# EAGLE design schmitt trigger (EAGLE 7.6.0)
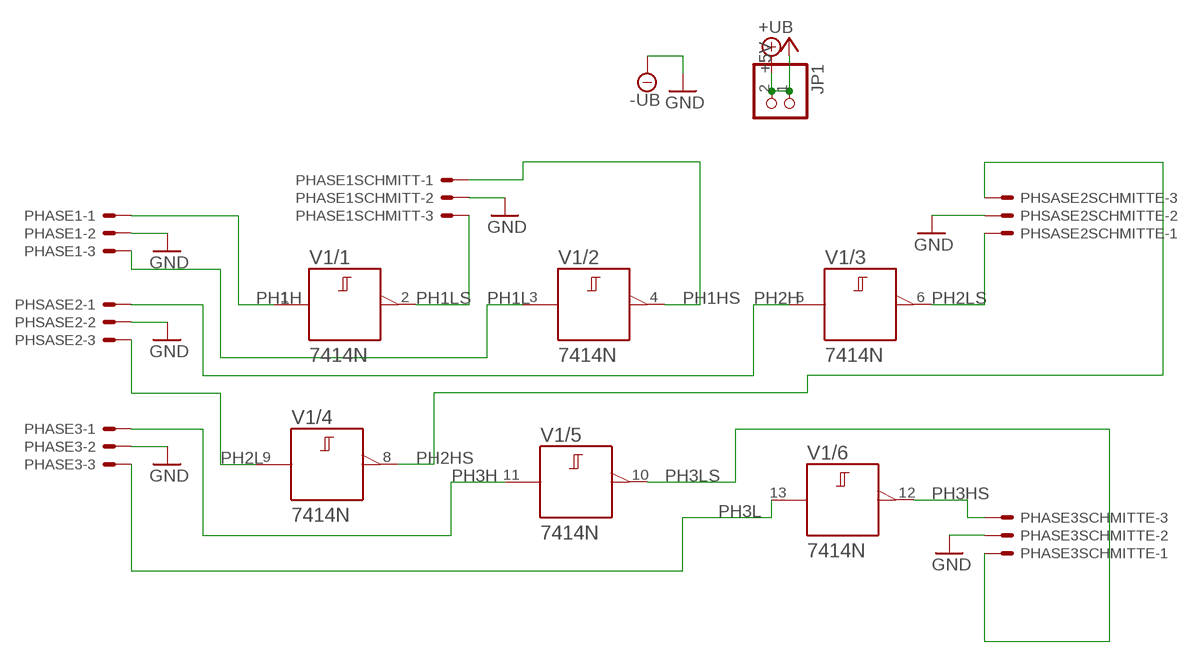
[diagram p0: schematic, sheet 1]

## Parts
JP1  PINHD-1X2  [1X02]
PHASE1  22-23-2031  [22-23-2031]
PHASE1SCHMITT  22-23-2031  [22-23-2031]
PHASE3  22-23-2031  [22-23-2031]
PHASE3SCHMITTE  22-23-2031  [22-23-2031]
PHSASE2  22-23-2031  [22-23-2031]
PHSASE2SCHMITTE  22-23-2031  [22-23-2031]
V1  7414N  [DIL14]

## Nets
+5V: JP1.1 JP1.2 ; supply symbol labelled +UB
GND: PHASE1.2 PHASE1SCHMITT.2 PHASE3.2 PHASE3SCHMITTE.2 PHSASE2.2 PHSASE2SCHMITTE.2 ; supply symbol labelled -UB
PH1H: PHASE1.1 V1.1(/1:A)
PH1HS: PHASE1SCHMITT.1 V1.4(/2:Y)
PH1L: PHASE1.3 V1.3(/2:A)
PH1LS: PHASE1SCHMITT.3 V1.2(/1:Y)
PH2H: PHSASE2.1 V1.5(/3:A)
PH2HS: PHSASE2SCHMITTE.3 V1.8(/4:Y)
PH2L: PHSASE2.3 V1.9(/4:A)
PH2LS: PHSASE2SCHMITTE.1 V1.6(/3:Y)
PH3H: PHASE3.1 V1.11(/5:A)
PH3HS: PHASE3SCHMITTE.3 V1.12(/6:Y)
PH3L: PHASE3.3 V1.13(/6:A)
PH3LS: PHASE3SCHMITTE.1 V1.10(/5:Y)

## Power pins joined to a net without a drawn wire
+5V: V1.14(/+UB:+UB)
GND: V1.7(/-UB:-UB)

## Library data of the parts
JP1 = pinhead:PINHD-1X2: PIN HEADER
PHASE1 PHASE1SCHMITT PHASE3 PHASE3SCHMITTE PHSASE2 PHSASE2SCHMITTE = con-molex:22-23-2031: .100" (2.54mm) Center Header - 3 Pin; MF: MOLEX; MPN: 22-23-2031; OC_FARNELL: 1462950; OC_NEWARK: 30C0862
V1 = 74ttl-din:74*14: Hex schmitt trigger INVERTER

## Net classes
0 default: width 0.635 mm, clearance 0.381 mm

## Board
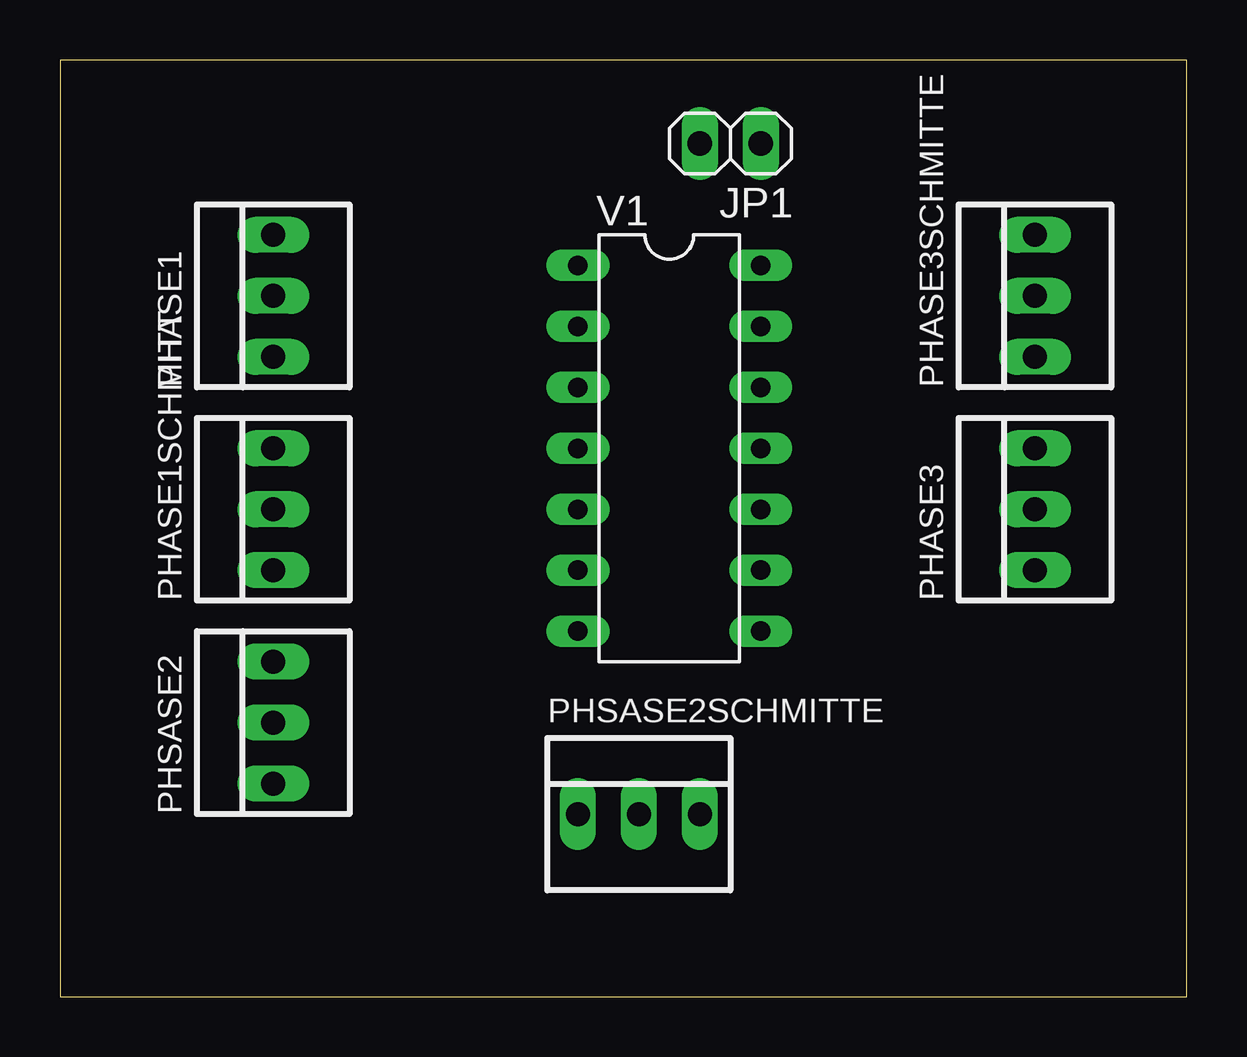
[diagram p1: board, top side]
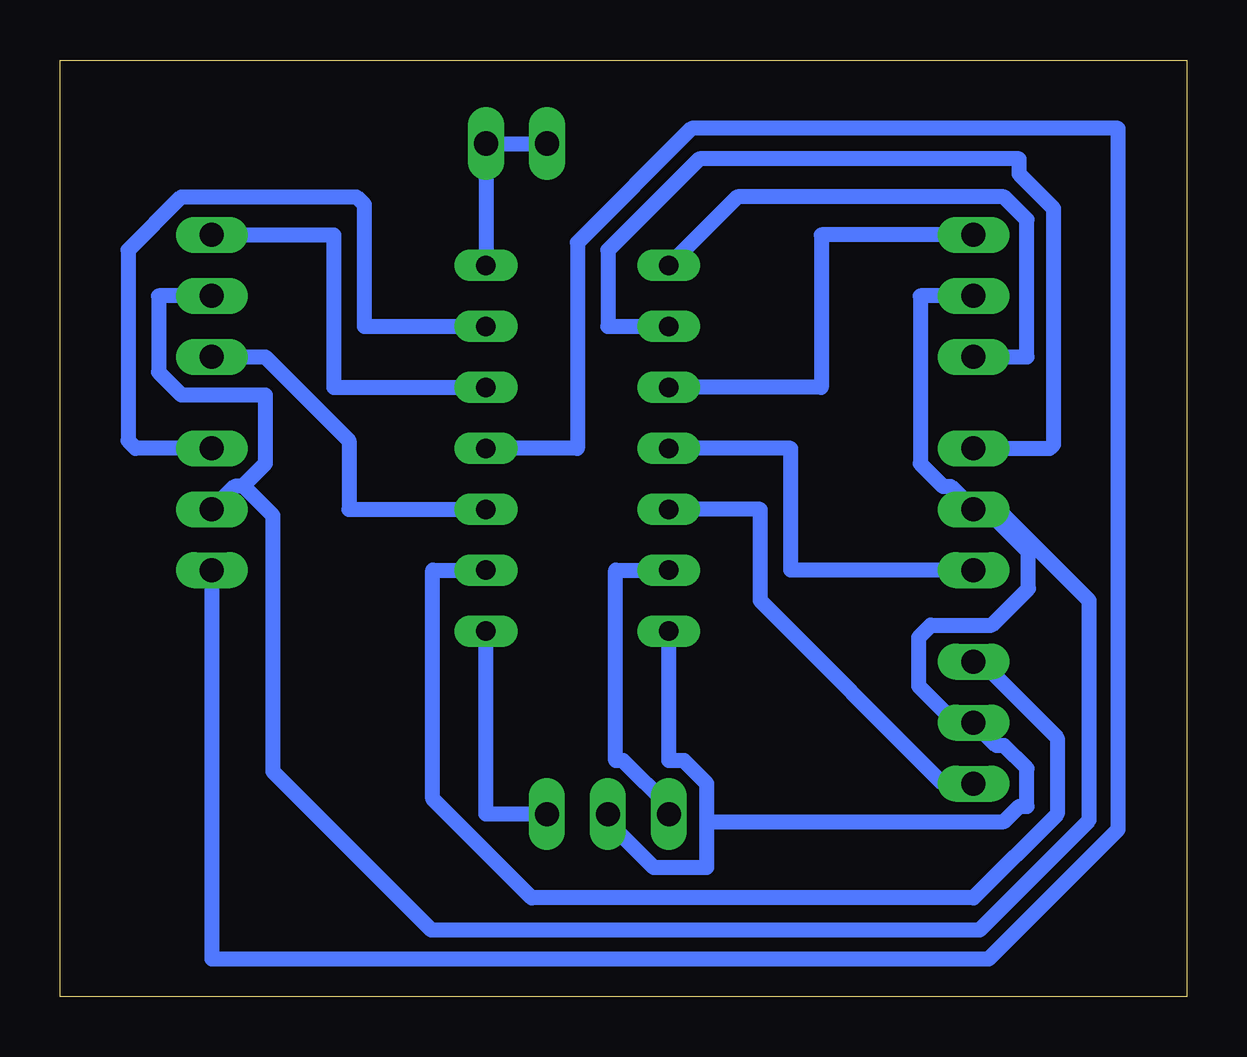
[diagram p2: board, bottom side, seen from below]

Size 46.97 x 39.04 mm. Coordinates in mm from the lower left corner, seen from the top.
Outline: 0,0 46.97,0 46.97,39.04 0,39.04 0,0
Copper layers (1*16): Top 0.035mm / dielectric 1.5mm / Bottom 0.035mm
Design rules "default": minimum track width 10mil, minimum drill 24mil, track to track 8mil, track to pad 8mil, pad to pad 8mil, via to via 8mil, smd to smd 8mil, copper to edge 40mil, drill to drill 8mil, minimum pad ring 10mil, minimum via ring 8mil, stop-mask expansion 4mil, vias tented up to drill 0mil, thermal gap 10mil

### Footprints (pad centres in the part's own frame; a part is rotated, then mirrored left to right if it is on the bottom)
1X02 = drill 1.016 long: 1 -1.27,0; 2 1.27,0
22-23-2031 = drill 1 long: 1 -2.54,0; 2 0,0; 3 2.54,0
DIL14 = drill 0.813 long: 1 -7.62,-3.81; 2 -5.08,-3.81; 3 -2.54,-3.81; 4 0,-3.81; 5 2.54,-3.81; 6 5.08,-3.81; 7 7.62,-3.81; 8 7.62,3.81; 9 5.08,3.81; 10 2.54,3.81; 11 0,3.81; 12 -2.54,3.81; 13 -5.08,3.81; 14 -7.62,3.81

### Placement (x,y rotation side)
JP1  27.94,35.56 180 top
PHASE1  8.89,29.21 90 top
PHASE1SCHMITT  8.89,20.32 90 top
PHASE3  40.64,20.32 90 top
PHASE3SCHMITTE  40.64,29.21 90 top
PHSASE2  8.89,11.43 90 top
PHSASE2SCHMITTE  24.13,7.62 0 top
V1  25.4,22.86 270 top

### Tracks (layer width: path | path; a pad name or v marks a point on that pad's centre or on a via)
+5V
  Bottom 0.635: V1.14 JP1.1 JP1.2
GND
  Bottom 0.635: PHASE3.2 39.69,21.27 39.37,21.27 39.34,21.3 | 39.34,21.3 38.42,22.23 38.42,25.08 41.91,25.08 42.86,26.04 42.86,29.21 PHASE3SCHMITTE.2 | PHASE1.2 11.11,29.21 11.11,22.23 10.16,21.27 9.84,21.27 PHASE1SCHMITT.2 8.64,20.07 | V1.7 21.59,9.84 20.95,9.84 20,8.89 20,7.3 | 20,7.3 20,5.4 22.22,5.4 24.13,7.3 PHSASE2SCHMITTE.2 | 20,7.3 7.62,7.3 6.98,7.94 6.67,7.94 6.67,9.53 7.62,10.48 7.94,10.48 PHSASE2.2 9.65,11.43 11.18,12.95 11.18,14.99 10.67,15.49 8.13,15.49 6.6,17.02 6.6,18.54 8.13,20.07 8.64,20.07 | 8.64,20.07 8.13,20.57 4.06,16.51 4.06,7.37 8.64,2.79 31.5,2.79 38.1,9.4 38.1,20.07 39.34,21.3
PH1H
  Bottom 0.635: V1.1 18.73,33.34 7.62,33.34 6.67,32.38 6.67,26.67 PHASE1.1
PH1HS
  Bottom 0.635: PHASE1SCHMITT.1 16.51,17.78 16.51,22.86 V1.4
PH1L
  Bottom 0.635: PHASE1.3 15.24,31.75 15.24,25.4 V1.3
PH1LS
  Bottom 0.635: PHASE1SCHMITT.3 5.71,22.86 5.56,23.02 5.56,32.86 6.98,34.29 6.98,34.93 20.32,34.93 24.13,31.12 24.13,27.94 V1.2
PH2H
  Bottom 0.635: V1.5 17.78,20.32 17.78,16.51 10.16,8.89 PHSASE2.1
PH2HS
  Bottom 0.635: V1.8 29.21,7.62 PHSASE2SCHMITTE.3
PH2L
  Bottom 0.635: V1.9 31.43,17.78 31.43,8.26 27.3,4.13 8.89,4.13 5.4,7.62 5.4,10.8 8.57,13.97 PHSASE2.3
PH2LS
  Bottom 0.635: PHSASE2SCHMITTE.1 21.59,7.94 23.49,9.84 23.81,9.84 23.81,17.78 V1.6
PH3H
  Bottom 0.635: V1.11 25.4,22.86 25.4,31.43 20.64,36.2 2.86,36.2 2.86,6.98 8.25,1.59 40.64,1.59 PHASE3.1
PH3HS
  Bottom 0.635: PHASE3SCHMITTE.3 35.56,31.75 35.56,25.4 V1.12
PH3L
  Bottom 0.635: PHASE3.3 43.81,22.86 44.13,23.18 44.13,31.12 41.91,33.34 34.61,33.34 34.29,33.02 34.29,27.94 V1.13
PH3LS
  Bottom 0.635: V1.10 34.92,20.32 34.92,23.18 38.42,26.67 PHASE3SCHMITTE.1